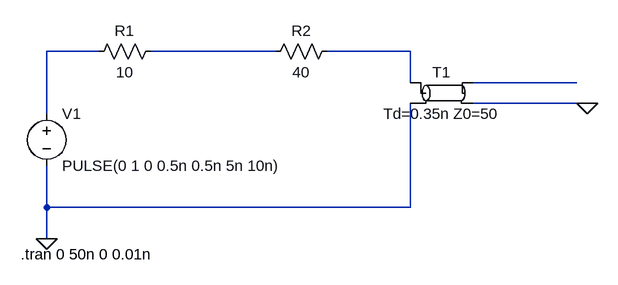
[diagram p0: schematic p13.asc]
p13.asc, the LTspice schematic file:
Version 4.1
SHEET 1 1072 680
WIRE 272 -16 192 -16
WIRE 544 -16 352 -16
WIRE 752 -16 624 -16
WIRE 752 32 752 -16
WIRE 1008 32 848 32
WIRE 1008 64 848 64
WIRE 192 80 192 -16
WIRE 192 224 192 160
WIRE 752 224 752 64
WIRE 752 224 192 224
WIRE 192 272 192 224
FLAG 192 272 0
FLAG 1024 64 0
SYMBOL voltage 192 64 R0
WINDOW 123 0 0 Left 0
WINDOW 39 0 0 Left 0
SYMATTR InstName V1
SYMATTR Value PULSE(0 1 0 0.5n 0.5n 5n 10n)
SYMBOL tline 800 48 R0
SYMATTR InstName T1
SYMATTR Value Td=0.35n Z0=50
SYMBOL res 640 -32 R90
WINDOW 0 0 56 VBottom 2
WINDOW 3 32 56 VTop 2
SYMATTR InstName R2
SYMATTR Value 40
SYMBOL res 368 -32 R90
WINDOW 0 0 56 VBottom 2
WINDOW 3 32 56 VTop 2
SYMATTR InstName R1
SYMATTR Value 10
TEXT 152 296 Left 2 !.tran 0 50n 0 0.01n

The netlist it stands for:
* p13.asc
V1 N001 0 PULSE(0 1 0 0.5n 0.5n 5n 10n)
T1 N003 0 N004 N005 Td=0.35n Z0=50
R2 N003 N002 40
R1 N002 N001 10
.tran 0 50n 0 0.01n
.backanno
.end